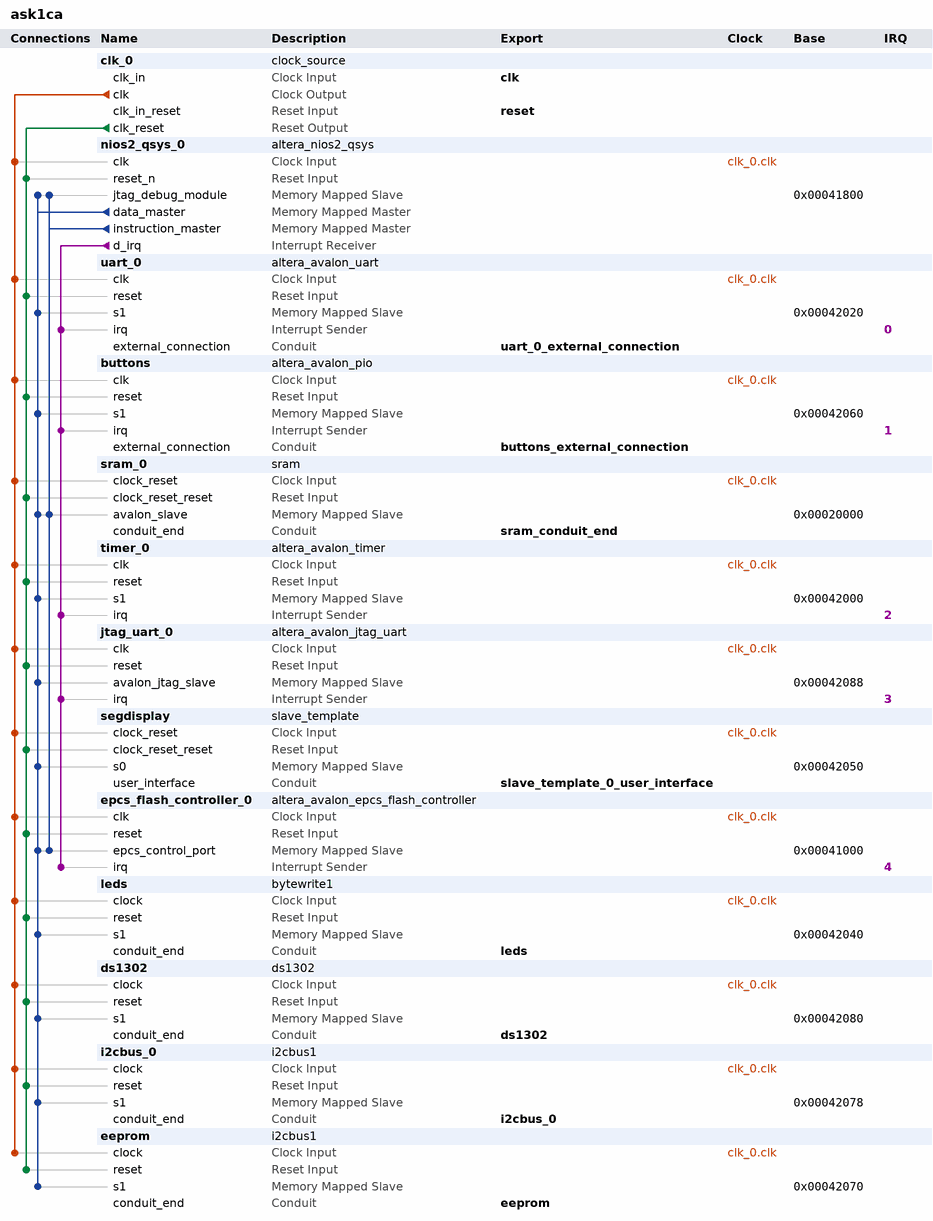
[diagram p0: system contents]
# Platform Designer (Qsys) system ask1ca, Cyclone EP1C3T144C8
# Parameters at their usual value, and those the tool derives, are not listed.
package require -exact qsys 13.0.1.99.2
create_system ask1ca
set_project_property DEVICE_FAMILY Cyclone
set_project_property DEVICE EP1C3T144C8

add_instance clk_0 clock_source 13.0
set_instance_parameter_value clk_0 clockFrequency 50000000

add_instance nios2_qsys_0 altera_nios2_qsys 13.0
set_instance_parameter_value nios2_qsys_0 resetSlave epcs_flash_controller_0.epcs_control_port
set_instance_parameter_value nios2_qsys_0 mmu_TLBMissExcSlave None
set_instance_parameter_value nios2_qsys_0 exceptionSlave sram_0.avalon_slave
set_instance_parameter_value nios2_qsys_0 breakSlave nios2_qsys_0.jtag_debug_module
set_instance_parameter_value nios2_qsys_0 muldiv_multiplierType NoneSmall
set_instance_parameter_value nios2_qsys_0 impl Tiny
set_instance_parameter_value nios2_qsys_0 icache_size 4096

add_instance uart_0 altera_avalon_uart 13.0.1.99.2
set_instance_parameter_value uart_0 baud 115200
set_instance_parameter_value uart_0 dataBits 8
set_instance_parameter_value uart_0 fixedBaud true
set_instance_parameter_value uart_0 parity NONE
set_instance_parameter_value uart_0 stopBits 1

add_instance buttons altera_avalon_pio 13.0.1.99.2
set_instance_parameter_value buttons captureEdge true
set_instance_parameter_value buttons direction Input
set_instance_parameter_value buttons edgeType FALLING
set_instance_parameter_value buttons generateIRQ true
set_instance_parameter_value buttons irqType EDGE
set_instance_parameter_value buttons width 3

add_instance sram_0 sram 1.0

add_instance timer_0 altera_avalon_timer 13.0.1.99.2
set_instance_parameter_value timer_0 period 1
set_instance_parameter_value timer_0 periodUnits SEC

add_instance jtag_uart_0 altera_avalon_jtag_uart 13.0.1.99.2
set_instance_parameter_value jtag_uart_0 simInteractiveOptions NO_INTERACTIVE_WINDOWS

add_instance segdisplay slave_template 1.0
set_instance_parameter_value segdisplay ENABLE_SYNC_SIGNALS 0

add_instance epcs_flash_controller_0 altera_avalon_epcs_flash_controller 13.0.1.99.2

add_instance leds bytewrite1 1.0

add_instance ds1302 ds1302 1.0

add_instance i2cbus_0 i2cbus1 1.0

add_instance eeprom i2cbus1 1.0

# connections
add_connection clk_0.clk buttons.clk clock
add_connection clk_0.clk ds1302.clock clock
add_connection clk_0.clk eeprom.clock clock
add_connection clk_0.clk epcs_flash_controller_0.clk clock
add_connection clk_0.clk i2cbus_0.clock clock
add_connection clk_0.clk jtag_uart_0.clk clock
add_connection clk_0.clk leds.clock clock
add_connection clk_0.clk nios2_qsys_0.clk clock
add_connection clk_0.clk segdisplay.clock_reset clock
add_connection clk_0.clk sram_0.clock_reset clock
add_connection clk_0.clk timer_0.clk clock
add_connection clk_0.clk uart_0.clk clock
add_connection clk_0.clk_reset buttons.reset reset
add_connection clk_0.clk_reset ds1302.reset reset
add_connection clk_0.clk_reset eeprom.reset reset
add_connection clk_0.clk_reset epcs_flash_controller_0.reset reset
add_connection clk_0.clk_reset i2cbus_0.reset reset
add_connection clk_0.clk_reset jtag_uart_0.reset reset
add_connection clk_0.clk_reset leds.reset reset
add_connection clk_0.clk_reset nios2_qsys_0.reset_n reset
add_connection clk_0.clk_reset segdisplay.clock_reset_reset reset
add_connection clk_0.clk_reset sram_0.clock_reset_reset reset
add_connection clk_0.clk_reset timer_0.reset reset
add_connection clk_0.clk_reset uart_0.reset reset
add_connection nios2_qsys_0.data_master buttons.s1 avalon
set_connection_parameter_value nios2_qsys_0.data_master/buttons.s1 baseAddress 0x00042060
add_connection nios2_qsys_0.data_master ds1302.s1 avalon
set_connection_parameter_value nios2_qsys_0.data_master/ds1302.s1 baseAddress 0x00042080
add_connection nios2_qsys_0.data_master eeprom.s1 avalon
set_connection_parameter_value nios2_qsys_0.data_master/eeprom.s1 baseAddress 0x00042070
add_connection nios2_qsys_0.data_master epcs_flash_controller_0.epcs_control_port avalon
set_connection_parameter_value nios2_qsys_0.data_master/epcs_flash_controller_0.epcs_control_port baseAddress 0x00041000
add_connection nios2_qsys_0.data_master i2cbus_0.s1 avalon
set_connection_parameter_value nios2_qsys_0.data_master/i2cbus_0.s1 baseAddress 0x00042078
add_connection nios2_qsys_0.data_master jtag_uart_0.avalon_jtag_slave avalon
set_connection_parameter_value nios2_qsys_0.data_master/jtag_uart_0.avalon_jtag_slave baseAddress 0x00042088
add_connection nios2_qsys_0.data_master leds.s1 avalon
set_connection_parameter_value nios2_qsys_0.data_master/leds.s1 baseAddress 0x00042040
add_connection nios2_qsys_0.data_master nios2_qsys_0.jtag_debug_module avalon
set_connection_parameter_value nios2_qsys_0.data_master/nios2_qsys_0.jtag_debug_module baseAddress 0x00041800
add_connection nios2_qsys_0.data_master segdisplay.s0 avalon
set_connection_parameter_value nios2_qsys_0.data_master/segdisplay.s0 baseAddress 0x00042050
add_connection nios2_qsys_0.data_master sram_0.avalon_slave avalon
set_connection_parameter_value nios2_qsys_0.data_master/sram_0.avalon_slave baseAddress 0x00020000
add_connection nios2_qsys_0.data_master timer_0.s1 avalon
set_connection_parameter_value nios2_qsys_0.data_master/timer_0.s1 baseAddress 0x00042000
add_connection nios2_qsys_0.data_master uart_0.s1 avalon
set_connection_parameter_value nios2_qsys_0.data_master/uart_0.s1 baseAddress 0x00042020
add_connection nios2_qsys_0.instruction_master epcs_flash_controller_0.epcs_control_port avalon
set_connection_parameter_value nios2_qsys_0.instruction_master/epcs_flash_controller_0.epcs_control_port baseAddress 0x00041000
add_connection nios2_qsys_0.instruction_master nios2_qsys_0.jtag_debug_module avalon
set_connection_parameter_value nios2_qsys_0.instruction_master/nios2_qsys_0.jtag_debug_module baseAddress 0x00041800
add_connection nios2_qsys_0.instruction_master sram_0.avalon_slave avalon
set_connection_parameter_value nios2_qsys_0.instruction_master/sram_0.avalon_slave baseAddress 0x00020000
add_connection nios2_qsys_0.d_irq buttons.irq interrupt
set_connection_parameter_value nios2_qsys_0.d_irq/buttons.irq irqNumber 1
add_connection nios2_qsys_0.d_irq epcs_flash_controller_0.irq interrupt
set_connection_parameter_value nios2_qsys_0.d_irq/epcs_flash_controller_0.irq irqNumber 4
add_connection nios2_qsys_0.d_irq jtag_uart_0.irq interrupt
set_connection_parameter_value nios2_qsys_0.d_irq/jtag_uart_0.irq irqNumber 3
add_connection nios2_qsys_0.d_irq timer_0.irq interrupt
set_connection_parameter_value nios2_qsys_0.d_irq/timer_0.irq irqNumber 2
add_connection nios2_qsys_0.d_irq uart_0.irq interrupt
set_connection_parameter_value nios2_qsys_0.d_irq/uart_0.irq irqNumber 0

# exported interfaces
add_interface clk clock sink
set_interface_property clk EXPORT_OF clk_0.clk_in
add_interface reset reset sink
set_interface_property reset EXPORT_OF clk_0.clk_in_reset
add_interface uart_0_external_connection conduit end
set_interface_property uart_0_external_connection EXPORT_OF uart_0.external_connection
add_interface buttons_external_connection conduit end
set_interface_property buttons_external_connection EXPORT_OF buttons.external_connection
add_interface sram_conduit_end conduit end
set_interface_property sram_conduit_end EXPORT_OF sram_0.conduit_end
add_interface slave_template_0_user_interface conduit end
set_interface_property slave_template_0_user_interface EXPORT_OF segdisplay.user_interface
add_interface leds conduit end
set_interface_property leds EXPORT_OF leds.conduit_end
add_interface ds1302 conduit end
set_interface_property ds1302 EXPORT_OF ds1302.conduit_end
add_interface i2cbus_0 conduit end
set_interface_property i2cbus_0 EXPORT_OF i2cbus_0.conduit_end
add_interface eeprom conduit end
set_interface_property eeprom EXPORT_OF eeprom.conduit_end

set_interconnect_requirement {$system} qsys_mm.clockCrossingAdapter HANDSHAKE
set_interconnect_requirement {$system} qsys_mm.maxAdditionalLatency 1

save_system ask1ca.qsys
